# EAGLE design audio-adapter (EAGLE 9.6.2)
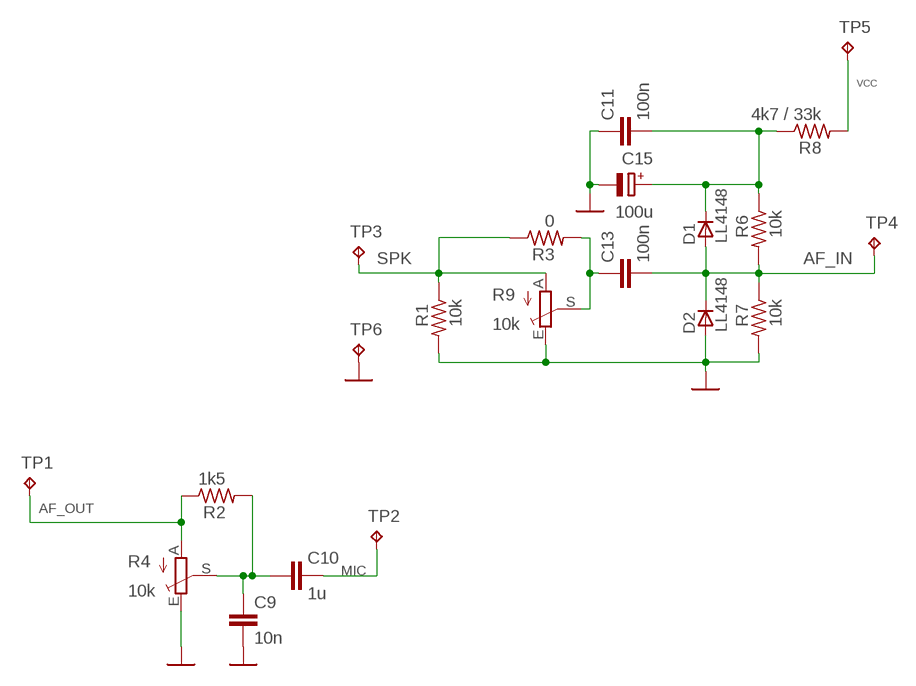
[diagram p0: schematic, sheet 1]

## Parts
C9  10n  C-EUC0805  [C0805]
C10  1u  C-EUC0805  [C0805]
C11  100n  C-EUC0805  [C0805]
C13  100n  C-EUC0805  [C0805]
C15  100u  CPOL-EUSMCD  [SMC_D]
D1  LL4148  [SOD80_DO213AA_MINIMELF]
D2  LL4148  [SOD80_DO213AA_MINIMELF]
R1  10k  R-US_R0805  [R0805]
R2  1k5  R-US_R0805  [R0805]
R3  0  R-US_R0805  [R0805]
R4  10k  TRIM_EU-CA6H  [CA6H]
R6  10k  R-US_R0805  [R0805]
R7  10k  R-US_R0805  [R0805]
R8  4k7 / 33k  R-US_R0805  [R0805]
R9  10k  TRIM_EU-CA6H  [CA6H]
TP1  TPB1,27  [B1,27]
TP2  TPB1,27  [B1,27]
TP3  TPB1,27  [B1,27]
TP4  TPB1,27  [B1,27]
TP5  TPB1,27  [B1,27]
TP6  TPB1,27  [B1,27]

## Nets
AF_IN: C13.2 D1.A D2.C R6.2 R7.1 TP4.TP
AF_OUT: R2.1 R4.A TP1.TP
GND: C9.2 C11.1 C15.- D2.A R1.2 R4.E R7.2 R9.E TP6.TP
MIC: C10.2 TP2.TP
N$2: C11.2 C15.+ D1.C R6.1 R8.1
N$4: C13.1 R3.2 R9.S
N$9: C9.1 C10.1 R2.2 R4.S
SPK: R1.1 R3.1 R9.A TP3.TP
VCC: R8.2 TP5.TP

## Library data of the parts
C9-C11 C13 = resistor:C-EU: CAPACITOR, European symbol
C15 = rcl:CPOL-EU: POLARIZED CAPACITOR, European symbol; SPICEPREFIX: C
D1 D2 = _hhn_diodes_smd:LL4148: 1N4148 General Purpose Rectifie SMD-Version of 1N4148 Case: SOD 80 = DO 213 AA = MINIMELF (Glass) Author: Dipl.-Ing. FH Rainer Bayer HHN Hochschule Heilbronn, rainer.bayer@hs-heilbronn.de Ingenieurbüro ing-rb, mail@ing-rb.de
R1-R3 R6-R8 = resistor:R-US_: RESISTOR, American symbol
R4 R9 = pot:TRIM_EU-: POTENTIOMETER
TP1-TP6 = testpad:TP: Test pad

## Board
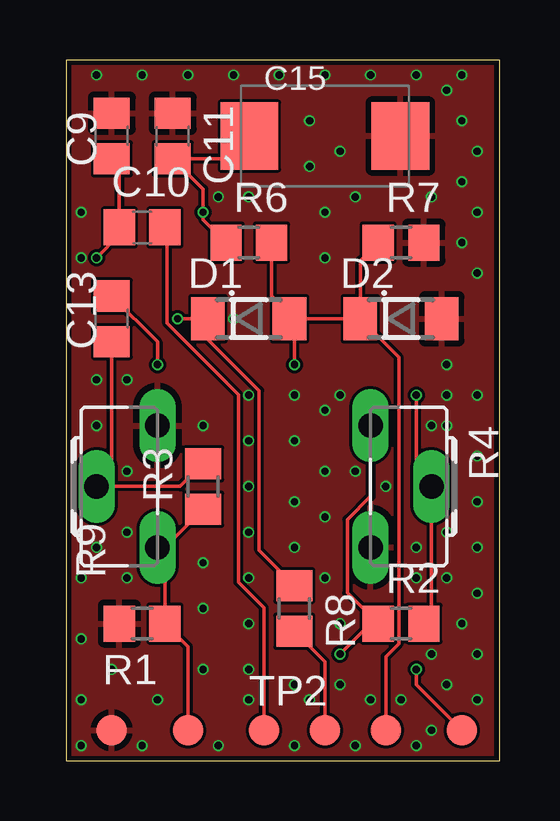
[diagram p1: board, top side]
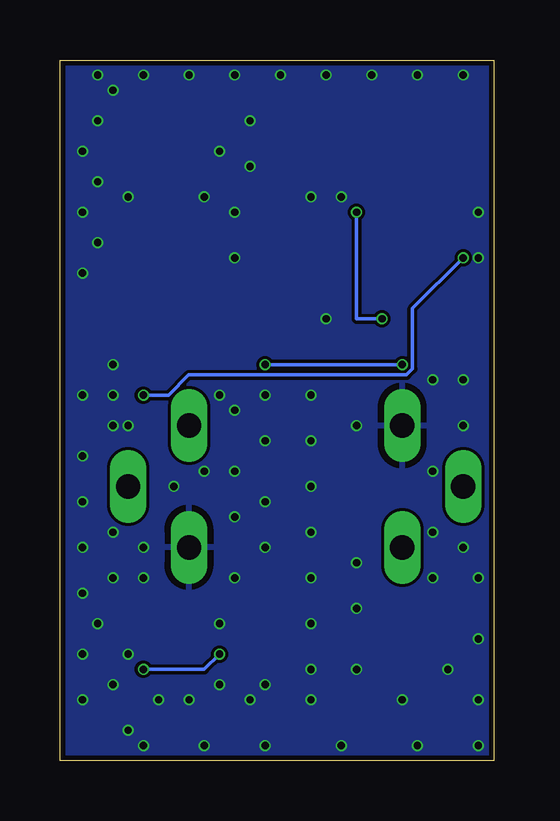
[diagram p2: board, bottom side, seen from below]

Size 18.09 x 29.2 mm. Coordinates in mm from the lower left corner, seen from the top.
Outline: 0,0 18.09,0 18.09,29.2 0,29.2 0,0
Copper layers (1*16): Top 0.035559375mm / dielectric 1.6mm / Bottom 0.035559375mm
Design rules "jlcpcb-2layers *": minimum track width 5mil, minimum drill 12mil, track to track 5mil, track to pad 5mil, pad to pad 5mil, via to via 5mil, smd to smd 5mil, copper to edge 8mil, drill to drill 6mil, minimum pad ring 5mil, minimum via ring 3mil, stop-mask expansion 2.5mil, vias tented up to drill 15mil, thermal gap 10mil

### Footprints (pad centres in the part's own frame; a part is rotated, then mirrored left to right if it is on the bottom)
C0805 = smd 1.3 x 1.5: 1 -0.95,0; 2 0.95,0
SMC_D = smd 2.4 x 2.8: + -3.15,0; - 3.15,0
SOD80_DO213AA_MINIMELF = smd 1.4 x 1.8: A 1.7,0; C -1.7,0
R0805 = smd 1.3 x 1.5: 1 -0.95,0; 2 0.95,0
CA6H = drill 1.016 long: A -2.54,0; E 2.54,0; S 0,2.54
B1,27 = smd 1.27 x 1.27: TP 0,0

### Placement (x,y rotation side)
C9  1.91,26.04 90 top
C10  3.17,22.23 0 top
C11  4.45,26.04 270 top
C13  1.91,18.41 90 top
C15  10.79,26.04 0 top
D1  7.62,18.41 0 top
D2  13.97,18.41 0 top
R1  3.17,5.71 180 top
R2  13.97,5.71 0 top
R3  5.71,11.43 90 top
R4  12.7,11.43 270 top
R6  7.62,21.59 0 top
R7  13.97,21.59 0 top
R8  9.53,6.35 270 top
R9  3.81,11.43 90 top
TP1  16.51,1.27 0 top
TP2  8.26,1.27 0 top
TP3  5.08,1.27 0 top
TP4  13.34,1.27 0 top
TP5  10.79,1.27 0 top
TP6  1.91,1.27 0 top

### Tracks (layer width: path | path; a pad name or v marks a point on that pad's centre or on a via)
AF_IN  (via drill 0.3)
  Top 0.152: TP4.TP 13.34,4.34 13.87,4.88 13.87,16.81 D2.C | 9.53,18.41 D1.A 9.53,18.21 v9.53,16.51 | 9.53,18.41 D2.C | D2.C 12.27,20.84 R7.1 | R6.2 8.57,19.37 9.53,18.41 | C13.2 3.81,17.46 v3.81,16.51
  Bottom 0.152: v3.81,16.51 v9.53,16.51
AF_OUT  (via drill 0.3)
  Top 0.152: TP1.TP 14.61,3.17 v14.61,3.81 | R4.A 12.7,11.02 11.73,10.05 11.73,7 R2.1 12.7,5.71 v11.43,4.45
  Bottom 0.152: v14.61,3.81 12.06,3.81 v11.43,4.45
GND  (via drill 0.3)
  other vias: 1.27,28.57 3.17,28.57 5.08,28.57 6.99,28.57 8.89,28.57 10.79,28.57 12.7,28.57 14.61,28.57 16.51,28.57 16.51,26.67 16.51,24.13 16.51,21.59 17.14,20.32 17.14,22.86 15.24,23.5 17.14,25.4 15.88,27.94 10.16,26.67 11.43,25.4 10.79,22.86 10.79,20.95 7.62,23.5 6.35,23.5 12.06,23.5 10.16,24.77 0.64,22.86 0.64,20.95 1.27,15.88 1.27,13.97 1.27,8.89 2.54,9.53 2.54,12.06 5.71,13.97 2.54,15.88 5.71,8.26 5.71,6.35 2.54,7.62 0.64,7.62 0.64,5.08 0.64,2.54 1.91,3.81 0.64,0.64 3.17,0.64 3.81,2.54 6.35,0.64 5.71,3.81 9.53,3.17 10.16,2.54 11.43,3.17 12.7,2.54 12.06,0.64 9.53,0.64 14.61,0.64 13.97,2.54 15.24,1.27 17.14,2.54 15.88,3.17 17.14,4.45 15.24,4.45 16.51,5.71 17.14,6.99 15.88,7.62 14.61,7.62 14.61,8.89 17.14,8.89 17.14,10.79 15.88,9.53 17.14,12.7 15.88,13.97 17.14,15.24 15.88,16.51 15.24,13.97 15.88,15.24 6.99,18.41 7.62,15.24 7.62,13.34 7.62,11.43 7.62,9.53 7.62,7.62 7.62,5.71 7.62,3.81 7.62,2.54 9.53,8.89 9.53,10.79 9.53,13.34 9.53,15.24 10.79,14.61 10.79,12.06 10.79,10.16 10.79,7.62 11.43,5.71 12.06,12.06 13.34,11.43 11.43,15.24
  pour Top: 0,0 17.78,0 17.78,29.21 0,29.21
  pour Bottom: 0,0 17.78,0 17.78,29.21 0,29.21
MIC
  Top 0.152: TP2.TP 8.26,6.37 7.19,7.44 7.19,15.26 4.22,18.23 4.22,22.13 C10.2
N$2  (via drill 0.3)
  Top 0.152: R6.1 5.71,22.55 v5.71,22.86 5.71,23.82 C11.2 6.7,25.09 C15.+ | R8.1 8.05,8.77 8.05,15.42 5.92,17.55 D1.C v4.65,18.41
  Bottom 0.152: v5.71,22.86 5.71,18.41 v4.65,18.41
N$4
  Top 0.152: R3.2 4.76,11.43 R9.S 1.91,12.06 C13.1
N$9  (via drill 0.3)
  Top 0.152: R2.2 15.24,6.04 R4.S 14.61,12.06 v14.61,15.24 | C9.1 2.23,24.77 C10.1 2.23,21.91 v1.27,20.95
  Bottom 0.152: v14.61,15.24 13.56,15.24 12.72,16.08 3.63,16.08 3.38,16.33 3.38,18.85 v1.27,20.95
SPK
  Top 0.152: TP3.TP 5.08,4.76 R1.1 4.12,8.57 R9.A 4.12,8.89 R3.1
VCC
  Top 0.152: TP5.TP 10.79,4.13 R8.2